# Altium schematic sheet Main scheme.SchDoc: Ethernet PHY with RJ45 connector
size A4; Date: Not used; ApprovedBy: Not used; CheckedBy: Not used; Author: Not used; CompanyName: STMicroelectronics; DrawnBy: Not used; Engineer: Not used; Organization: Not used; Address1: Not used; Address2: Not used; Address3: Not used; Address4: Not used; DocumentNumber: 6; Revision: Not used; SheetNumber: 6; SheetTotal: 9; Time: Not used; ImagePath: Not used; Application_BuildNumber: Not used
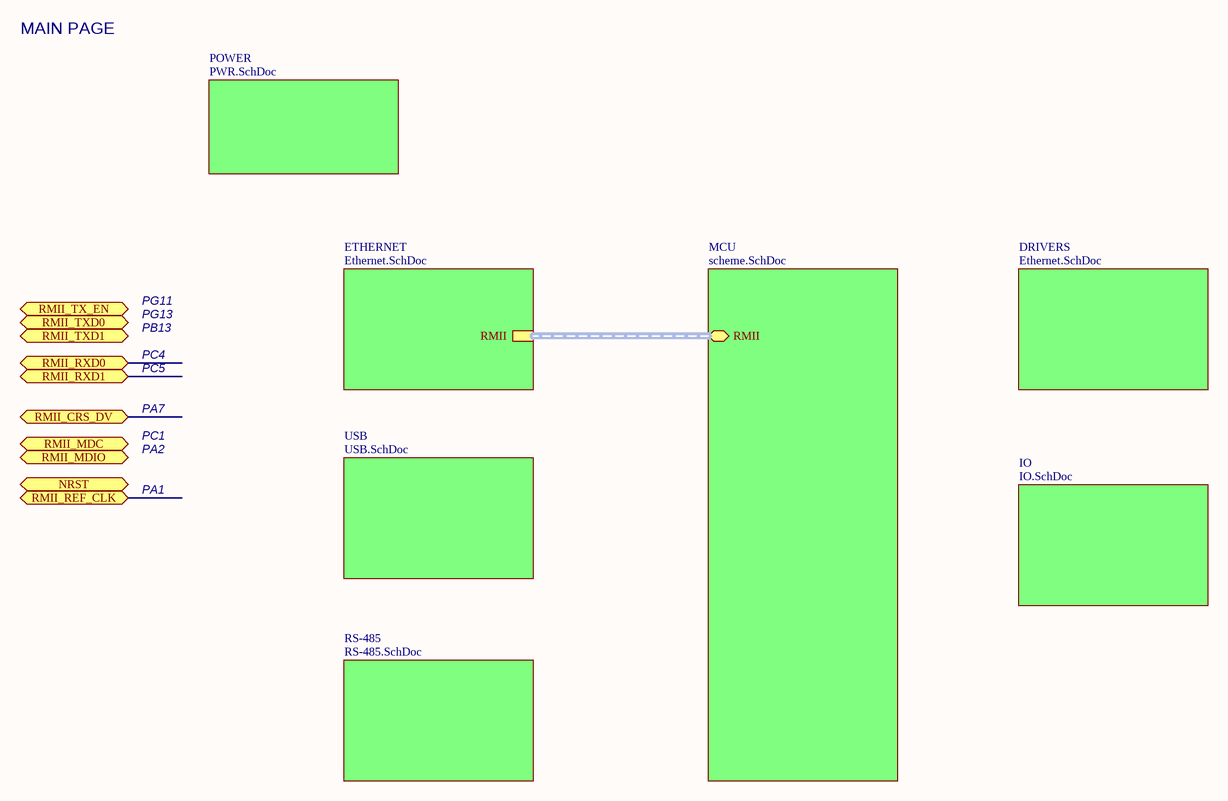
[diagram p0: Main scheme.SchDoc]

## Sub-sheets
DRIVERS = Ethernet.SchDoc: no entries
ETHERNET = Ethernet.SchDoc: RMII
IO = IO.SchDoc: no entries
MCU = scheme.SchDoc: RMII (bidir)
POWER = PWR.SchDoc: no entries
RS-485 = RS-485.SchDoc: no entries
USB = USB.SchDoc: no entries

## Ports
NRST (bidir), RMII_CRS_DV (bidir), RMII_MDC (bidir), RMII_MDIO (bidir), RMII_REF_CLK (bidir), RMII_RXD0 (bidir), RMII_RXD1 (bidir), RMII_TX_EN (bidir), RMII_TXD0 (bidir), RMII_TXD1 (bidir)

## Buses and harness runs
harness sheet ETHERNET/RMII = sheet MCU/RMII

## Notes on the sheet
- MAIN PAGE
- PG11
- PG13
- PB13
- PC4
- PC5
- PA7
- PC1
- PA2
- PA1
- Title:
- Project:
- Size:
- Revision:
- Variant:
- A4
- -
- Date:
- Reference:
- Sheet:
- of